# EasyEDA Pro project ProProject_PressureSensor_2023-10-08.epro, board PCB1_2
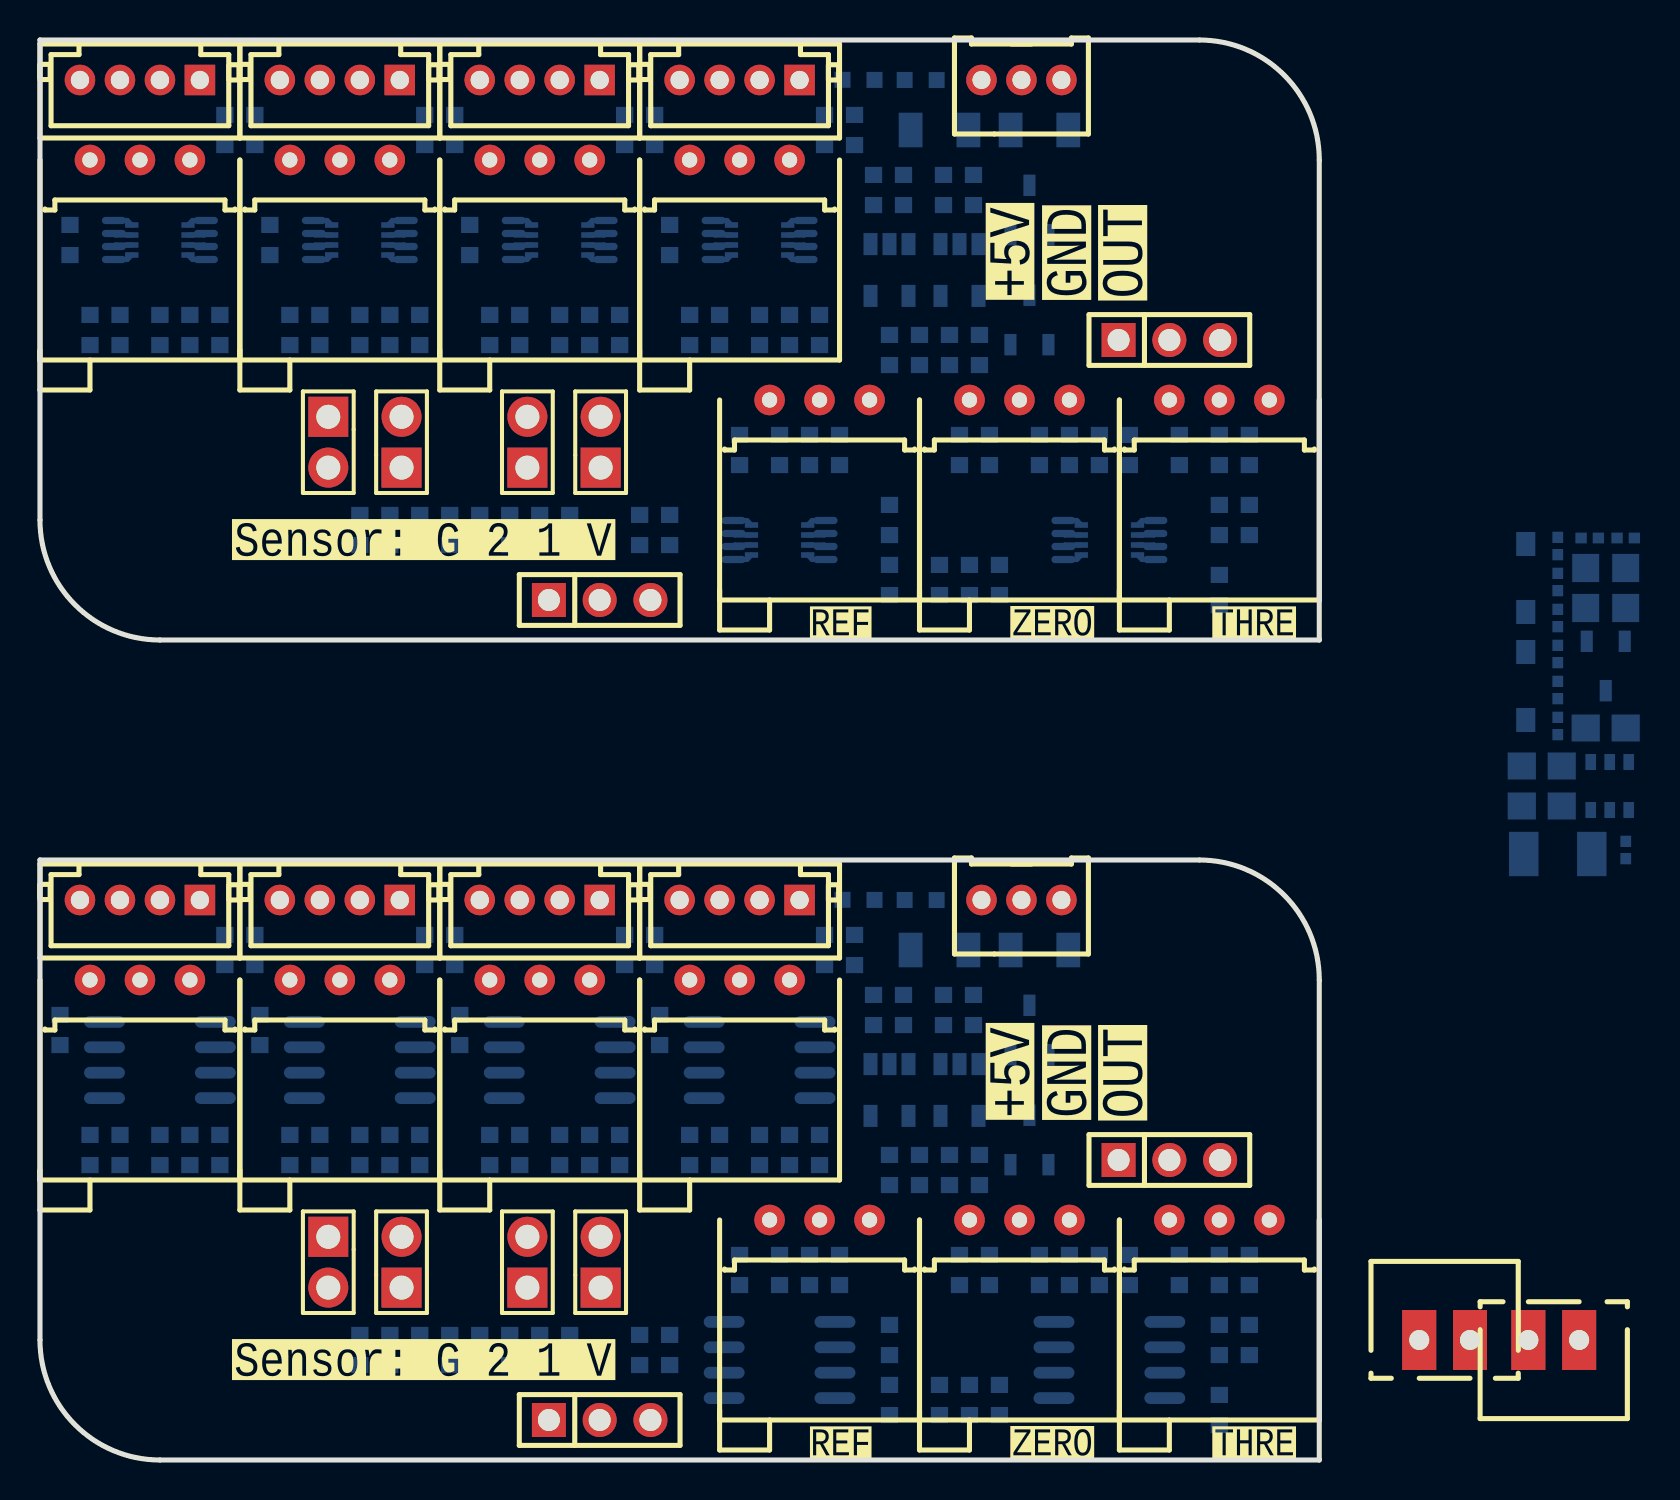
[diagram p5: board, top side]
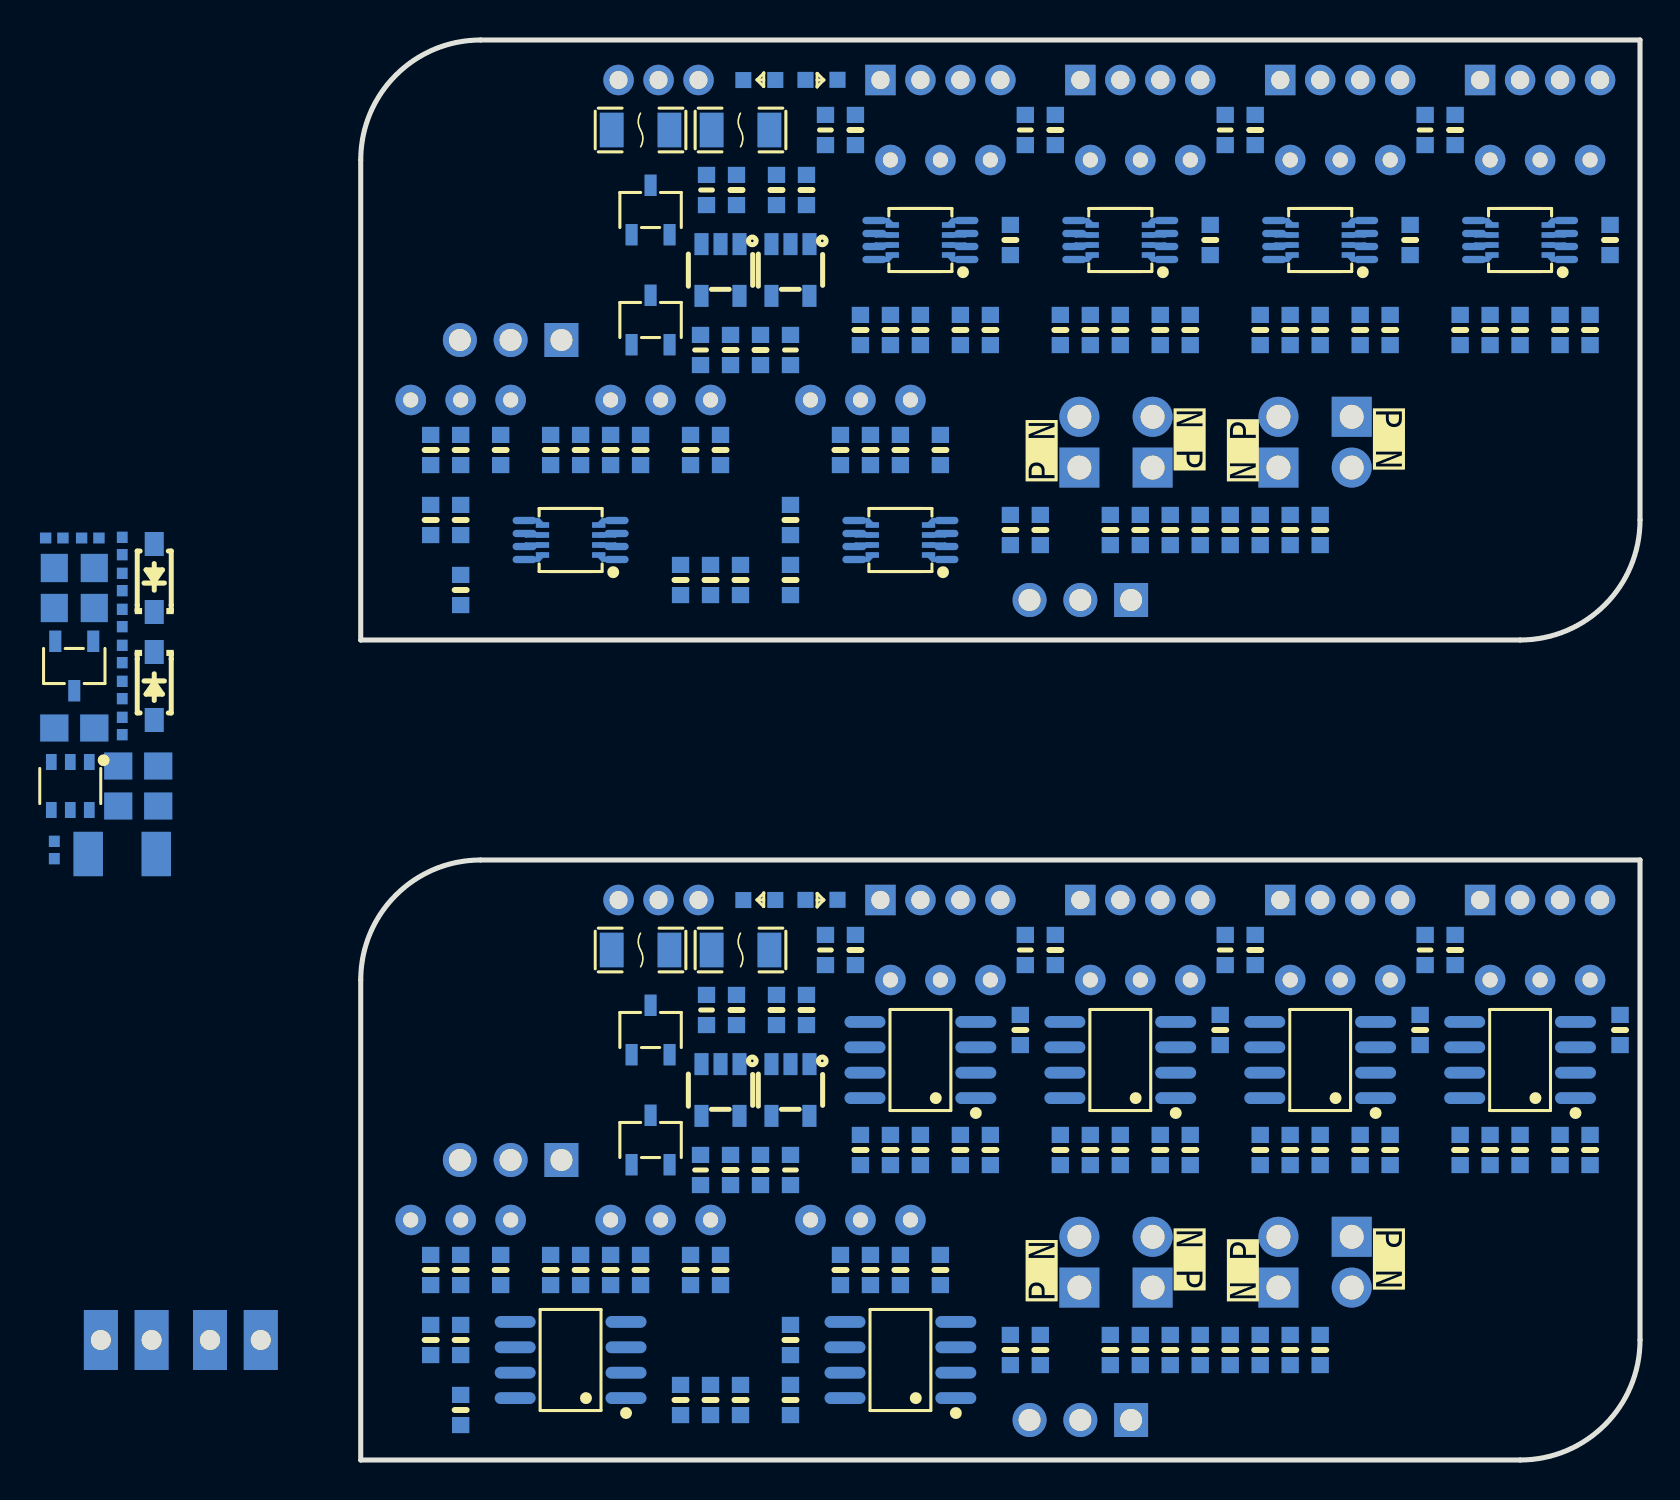
[diagram p6: board, bottom side, seen from below]

Outline 64 x 71 mm; copper layers: Top Layer, Inner1, Inner2, Bottom Layer. Coordinates in mm from the lower left corner of the outline.
Outline path: 0,47 0,71 58,71 arc(62.24,69.24) 64,65 64,41 6,41 arc(1.76,42.76) 0,47 ; 0,6 0,30 58,30 arc(62.24,28.24) 64,24 64,0 6,0 arc(1.76,1.76) 0,6
Stack: Top Layer 0.035mm / Dielectric1 0.48mm PP er 4.5 / Inner1 0.035mm / Dielectric2 0.48mm FR4 er 4.5 / Inner2 0.035mm / Dielectric3 0.48mm PP er 4.5 / Bottom Layer 0.035mm

## Design rules (mm)
template: 自定义配置
spacing copperThickness1oz (default): track to track 0.102, other pairs 0.152 to 0.3
spacing copperThickness2oz: track to track 0.203, other pairs 0.152 to 0.3
track width copperThickness1oz (default): min 0.127, default 0.254, max 2.54
track width copperThickness2oz: min 0.203, default 0.254, max 2.54
differential pair differentialPair (default): width min 0.127, default 0.254, max 2.54; gap min 0.152, default 0.152
via viaSize (default): diameter min 0.5, default 0.61, max 10; hole min 0.3, default 0.305, max 6.3
net GND uses innerPlaneGND

## Placement (name value [footprint] x y rotation side)
C1  22uF  [R0603]  46.7 22.5 270 bottom
C1#2  -  [R0603]  46.7 63.5 270 bottom
C2  0.1uF  [R0603]  45.2 63.5 90 bottom
C2#2  -  [R0603]  45.2 22.5 90 bottom
C3  1uF  [R0603]  41.7 63.5 90 bottom
C3#2  -  [R0603]  41.7 22.5 90 bottom
C4  10uF  [R0603]  42.5 14.5 90 bottom
C4#2  -  [R0603]  42.5 55.5 90 bottom
C5  0.1uF  [R0603]  44 55.5 270 bottom
C5#2  -  [R0603]  44 14.5 270 bottom
C7  10uF  [R0603]  47 14.5 90 bottom
C7#2  -  [R0603]  47 55.5 90 bottom
C8  0.1uF  [R0603]  45.5 55.5 270 bottom
C8#2  -  [R0603]  45.5 14.5 270 bottom
C9  22uF  [R0603]  10.75 66.5 90 bottom
C9#2  -  [R0603]  10.75 25.5 90 bottom
C10  100p  [R0603]  31.5 5.5 90 bottom
C10#2  -  [R0603]  31.5 46.5 90 bottom
C11  100p  [R0603]  2.5 56.5 90 bottom
C11#2  -  [R0603]  2.5 15.5 90 bottom
C12  100p  [R0603]  38.5 9.5 90 bottom
C12#2  -  [R0603]  38.5 50.5 90 bottom
C13  100p  [R0603]  9 56.5 270 bottom
C13#2  -  [R0603]  9 15.5 270 bottom
C14  100p  [R0603]  46.5 44 90 bottom
C14#2  -  [R0603]  46.5 3 90 bottom
C15  100p  [R0603]  59 47 90 bottom
C15#2  -  [R0603]  59 6 90 bottom
C16  1uF  [R0603]  40 9.5 90 bottom
C16#2  -  [R0603]  40 50.5 90 bottom
C17  1uF  [R0603]  50 50.5 90 bottom
C17#2  -  [R0603]  50 9.5 90 bottom
C18  1uF  [R0603]  59 50.5 90 bottom
C18#2  -  [R0603]  59 9.5 90 bottom
C19  22uF  [R0603]  20.75 66.5 90 bottom
C19#2  -  [R0603]  20.75 25.5 90 bottom
C20  100p  [R0603]  12.5 56.5 90 bottom
C20#2  -  [R0603]  12.5 15.5 90 bottom
C20#3  -  [R0402]  79.33 46.1 0 bottom
C21  100p  [R0603]  19 56.5 270 bottom
C21#2  -  [R0603]  19 15.5 270 bottom
C22  0.1uF  [R0603]  1.5 61 90 bottom
C22#2  -  [R0603]  1 21.5 270 bottom
C23  0.1uF  [R0603]  11.5 61 90 bottom
C23#2  -  [R0603]  11 21.5 270 bottom
C24  0.1uF  [R0603]  21.5 61 90 bottom
C24#2  -  [R0603]  21 21.5 270 bottom
C25  0.1uF  [R0603]  31.5 61 90 bottom
C25#2  -  [R0603]  31 21.5 270 bottom
C26  0.1uF  [R0603]  42.5 44 90 bottom
C26#2  -  [R0603]  42.5 3 90 bottom
C27  0.1uF  [R0603]  59 43.5 90 bottom
C27#2  -  [R0603]  59 2.5 90 bottom
C27#3  -  [C0805]  77.33 43.6 270 bottom
C28  22uF  [R0603]  30.75 66.5 90 bottom
C28#2  -  [R0603]  30.75 25.5 90 bottom
C29  100p  [R0603]  22.5 56.5 90 bottom
C29#2  -  [R0603]  22.5 15.5 90 bottom
C29#3  -  [C0805]  78.33 36.6 0 bottom
C30  22uF  [R0402]  79.33 30.5 90 bottom
C30#2  -  [R0603]  40.75 66.5 90 bottom
C30#3  -  [R0603]  40.75 25.5 90 bottom
C31  100p  [R0603]  32.5 56.5 90 bottom
C31#2  -  [R0603]  32.5 15.5 90 bottom
C31#3  -  [C0805]  75.13 32.7 180 bottom
C32  100p  [R0603]  29 56.5 270 bottom
C32#2  -  [R0603]  29 15.5 270 bottom
C32#3  -  [C0805]  75.13 34.7 180 bottom
C33  100p  [R0603]  39 56.5 270 bottom
C33#2  -  [R0603]  39 15.5 270 bottom
C33#3  -  [C0805]  79.33 43.6 270 bottom
CN1  HDGC2001WV-4P  [CONN-TH_B2B-XH-A-LF-SN]  70.27 6.5 0 top
CN1#2  -  [CONN-TH_4P-P2.00_HDGC_HDGC2001WV-4P]  5 28 180 top
CN1#3  -  [CONN-TH_4P-P2.00_HDGC_HDGC2001WV-4P]  5 69 180 top
CN2  HDGC2001WV-4P  [CONN-TH_B2B-XH-A-LF-SN]  75.73 5.5 180 top
CN2#2  -  [CONN-TH_4P-P2.00_HDGC_HDGC2001WV-4P]  15 28 180 top
CN2#3  -  [CONN-TH_4P-P2.00_HDGC_HDGC2001WV-4P]  15 69 180 top
CN3  HDGC2001WV-4P  [CONN-TH_4P-P2.00_HDGC_HDGC2001WV-4P]  25 28 180 top
CN3#2  -  [CONN-TH_4P-P2.00_HDGC_HDGC2001WV-4P]  25 69 180 top
CN4  HDGC2001WV-4P  [CONN-TH_4P-P2.00_HDGC_HDGC2001WV-4P]  35 28 180 top
CN4#2  -  [CONN-TH_4P-P2.00_HDGC_HDGC2001WV-4P]  35 69 180 top
D5  B5819W SL  [SOD-123_L2.7-W1.6-LS3.7-RD-1]  74.33 44.1 90 bottom
D6  B5819W SL  [SOD-123_L2.7-W1.6-LS3.7-RD-1]  74.33 38.7 270 bottom
F1  nSMD020-30V  [F1206]  45 66.5 180 bottom
F1#2  -  [F1206]  45 25.5 180 bottom
F2  nSMD020-30V  [F1206]  50 66.5 180 bottom
F2#2  -  [F1206]  50 25.5 180 bottom
H2  PZ254V-11-03P  [HDR-TH_3P-P2.54-V-M]  28 43 0 top
H2#2  -  [HDR-TH_3P-P2.54-V-M]  28 2 0 top
H4  PZ254V-11-03P  [HDR-TH_3P-P2.54-V-M]  56.5 56 0 top
H4#2  -  [HDR-TH_3P-P2.54-V-M]  56.5 15 0 top
H5  PZ254V-11-02P  [HDR-TH_2P-P2.54-V-M]  14.42 50.89 270 top
H5#2  -  [HDR-TH_2P-P2.54-V-M]  14.42 9.89 270 top
H6  PZ254V-11-02P  [HDR-TH_2P-P2.54-V-M]  24.38 50.89 90 top
H6#2  -  [HDR-TH_2P-P2.54-V-M]  24.38 9.89 90 top
H7  PZ254V-11-02P  [HDR-TH_2P-P2.54-V-M]  28.05 50.89 90 top
H7#2  -  [HDR-TH_2P-P2.54-V-M]  28.05 9.89 90 top
H8  PZ254V-11-02P  [HDR-TH_2P-P2.54-V-M]  18.09 50.89 90 top
H8#2  -  [HDR-TH_2P-P2.54-V-M]  18.09 9.89 90 top
L2  4.7uH  [L1210]  75.93 30.3 0 bottom
LED3  -  [LED_0603]  41 69 0 bottom
LED3#2  -  [LED_0603]  41 28 0 bottom
LED4  -  [LED_0603]  44.01 28.01 180 bottom
LED4#2  -  [LED_0603]  44.01 69.01 180 bottom
P1  PH-3A  [CONN-TH_12P-P2.00-H-W4.8_PH-3A]  49.1 69 270 top
P1#2  -  [CONN-TH_12P-P2.00-H-W4.8_PH-3A]  49.1 28 270 top
Q1  S8050  [SOT-23-3_L2.9-W1.6-P1.90-LS2.8-BR]  49.5 57 270 bottom
Q1#2  -  [SOT-23-3_L2.9-W1.6-P1.90-LS2.8-BR]  78.33 39.7 90 bottom
Q1#3  -  [SOT-23-3_L2.9-W1.6-P1.90-LS2.8-BR]  49.5 16 270 bottom
R2  2K  [R0603]  16 46.5 90 bottom
R2#2  -  [R0603]  16 5.5 90 bottom
R3  15K  [R0603]  30 46.5 90 bottom
R3#2  -  [R0603]  30 5.5 90 bottom
R4  2K  [R0603]  19 46.5 90 bottom
R4#2  -  [R0603]  19 5.5 90 bottom
R5  50  [RES-ADJ-TH_3P-L10.0-W10.0-P2.50-L]  5 65 0 top
R5#2  -  [RES-ADJ-TH_3P-L10.0-W10.0-P2.50-L]  5 24 0 top
R6  50  [R0603]  9.25 66.5 270 bottom
R6#2  -  [R0603]  9.25 25.5 270 bottom
R7  2K  [R0603]  22 46.5 90 bottom
R7#2  -  [R0603]  22 5.5 90 bottom
R8  2K  [R0603]  4 56.5 90 bottom
R8#2  -  [R0603]  4 15.5 90 bottom
R9  2K  [R0603]  25 46.5 90 bottom
R9#2  -  [R0603]  25 5.5 90 bottom
R10  2K  [R0603]  17.5 46.5 90 bottom
R10#2  -  [R0603]  17.5 5.5 90 bottom
R11  120  [R0603]  6 56.5 270 bottom
R11#2  -  [R0603]  6 15.5 270 bottom
R12  2K  [R0603]  20.5 46.5 90 bottom
R12#2  -  [R0603]  20.5 5.5 90 bottom
R13  2K  [R0603]  23.5 46.5 90 bottom
R13#2  -  [R0603]  23.5 5.5 90 bottom
R14  2K  [R0603]  45 44 90 bottom
R14#2  -  [R0603]  45 3 90 bottom
R14#3  -  [R0402]  75.93 45.7 270 bottom
R15  2K  [R0603]  7.5 56.5 270 bottom
R15#2  -  [R0603]  7.5 15.5 270 bottom
R15#3  -  [R0402]  77.53 46.1 180 bottom
R16  2K  [R0603]  26.5 46.5 90 bottom
R16#2  -  [R0603]  26.5 5.5 90 bottom
R16#3  -  [R0402]  75.93 40.3 90 bottom
R17  15K  [R0603]  37 9.5 90 bottom
R17#2  -  [R0603]  37 50.5 90 bottom
R17#3  -  [R0402]  75.93 42.1 90 bottom
R18  15K  [R0603]  48 44 90 bottom
R18#2  -  [R0603]  48 3 90 bottom
R18#3  -  [R0402]  75.93 38.5 90 bottom
R19  2K  [R0603]  53 50.5 90 bottom
R19#2  -  [R0603]  53 9.5 90 bottom
R19#3  -  [R0402]  75.93 36.7 90 bottom
R20  100K  [R0603]  54.5 50.5 90 bottom
R20#2  -  [R0603]  54.5 9.5 90 bottom
R20#3  -  [R0402]  75.93 43.9 90 bottom
R21  2K  [R0603]  46 9.5 270 bottom
R21#2  -  [R0603]  46 50.5 270 bottom
R22  2K  [R0603]  42.5 6 90 bottom
R22#2  -  [R0603]  42.5 47 90 bottom
R23  2K  [R0603]  51.5 9.5 270 bottom
R23#2  -  [R0603]  51.5 50.5 270 bottom
R24  2K  [R0603]  60.5 50.5 270 bottom
R24#2  -  [R0603]  60.5 9.5 270 bottom
R25  10K  [RES-ADJ-TH_3P-L10.0-W10.0-P2.50-L]  39 12 0 top
R25#2  -  [RES-ADJ-TH_3P-L10.0-W10.0-P2.50-L]  39 53 0 top
R26  10K  [RES-ADJ-TH_3P-L10.0-W10.0-P2.50-L]  49 12 0 top
R26#2  -  [RES-ADJ-TH_3P-L10.0-W10.0-P2.50-L]  49 53 0 top
R27  10K  [RES-ADJ-TH_3P-L10.0-W10.0-P2.50-L]  59 12 0 top
R27#2  -  [RES-ADJ-TH_3P-L10.0-W10.0-P2.50-L]  59 53 0 top
R28  5K  [R0603]  60.5 47 270 bottom
R28#2  -  [R0603]  60.5 6 270 bottom
R29  2K  [R0603]  35 9.5 90 bottom
R29#2  -  [R0603]  35 50.5 90 bottom
R30  2K  [R0603]  47.5 9.5 90 bottom
R30#2  -  [R0603]  47.5 50.5 90 bottom
R31  2K  [R0603]  57 50.5 90 bottom
R31#2  -  [R0603]  57 9.5 90 bottom
R33  50  [RES-ADJ-TH_3P-L10.0-W10.0-P2.50-L]  15 65 0 top
R33#2  -  [RES-ADJ-TH_3P-L10.0-W10.0-P2.50-L]  15 24 0 top
R34  50  [R0603]  19.25 66.5 270 bottom
R34#2  -  [R0603]  19.25 25.5 270 bottom
R35  2K  [R0603]  14 56.5 90 bottom
R35#2  -  [R0603]  14 15.5 90 bottom
R36  120  [R0603]  16 56.5 270 bottom
R36#2  -  [R0603]  16 15.5 270 bottom
R37  2K  [R0603]  17.5 56.5 270 bottom
R37#2  -  [R0603]  17.5 15.5 270 bottom
R38  50  [RES-ADJ-TH_3P-L10.0-W10.0-P2.50-L]  25 65 0 top
R38#2  -  [RES-ADJ-TH_3P-L10.0-W10.0-P2.50-L]  25 24 0 top
R39  50  [R0603]  29.25 66.5 270 bottom
R39#2  -  [R0603]  29.25 25.5 270 bottom
R40  50  [RES-ADJ-TH_3P-L10.0-W10.0-P2.50-L]  35 65 0 top
R40#2  -  [RES-ADJ-TH_3P-L10.0-W10.0-P2.50-L]  35 24 0 top
R41  2K  [R0603]  24 56.5 90 bottom
R41#2  -  [R0603]  24 15.5 90 bottom
R42  50  [R0603]  39.25 66.5 270 bottom
R42#2  -  [R0603]  39.25 25.5 270 bottom
R43  2K  [R0603]  34 56.5 90 bottom
R43#2  -  [R0603]  34 15.5 90 bottom
R44  120  [R0603]  26 56.5 270 bottom
R44#2  -  [R0603]  26 15.5 270 bottom
R45  120  [R0603]  36 56.5 270 bottom
R45#2  -  [R0603]  36 15.5 270 bottom
R46  2K  [R0603]  27.5 56.5 270 bottom
R46#2  -  [R0603]  27.5 15.5 270 bottom
R47  2K  [R0603]  37.5 56.5 270 bottom
R47#2  -  [R0603]  37.5 15.5 270 bottom
R48  10K  [R0603]  43.2 22.5 270 bottom
R48#2  -  [R0603]  43.2 63.5 270 bottom
TV1  ESDA5V3L  [SOT-23-3_L2.9-W1.6-P1.90-LS2.8-BR]  49.5 62.5 270 bottom
TV1#2  -  [SOT-23-3_L2.9-W1.6-P1.90-LS2.8-BR]  49.5 21.5 270 bottom
U1  LP5907MFX-4.5/NOPB  [TSOT-23-5_L2.9-W1.6-P0.95-LS2.8-BR]  42.5 18.5 90 bottom
U1#2  -  [TSOT-23-5_L2.9-W1.6-P0.95-LS2.8-BR]  42.5 59.5 90 bottom
U2  LP5907MFX-4.5/NOPB  [TSOT-23-5_L2.9-W1.6-P0.95-LS2.8-BR]  46 59.5 90 bottom
U2#2  -  [TSOT-23-5_L2.9-W1.6-P0.95-LS2.8-BR]  46 18.5 90 bottom
U2#3  -  [TSOT-23-6_L2.9-W1.6-P0.95-LS2.8-BR]  78.53 33.7 90 bottom
U3  TLV2333IDGKR  [VSSOP-8_L3.0-W3.0-P0.65-LS5.0-BL]  6 61 90 bottom
U3#2  -  [SOIC-8_L4.9-W3.9-P1.27-LS6.0-BL]  6 20 90 bottom
U4  TLV2333IDGKR  [VSSOP-8_L3.0-W3.0-P0.65-LS5.0-BL]  37 46 90 bottom
U4#2  -  [SOIC-8_L4.9-W3.9-P1.27-LS6.0-BL]  37 5 90 bottom
U5  TLV2333IDGKR  [VSSOP-8_L3.0-W3.0-P0.65-LS5.0-BL]  53.5 46 90 bottom
U5#2  -  [SOIC-8_L4.9-W3.9-P1.27-LS6.0-BL]  53.5 5 90 bottom
U6  TLV2333IDGKR  [VSSOP-8_L3.0-W3.0-P0.65-LS5.0-BL]  16 61 90 bottom
U6#2  -  [SOIC-8_L4.9-W3.9-P1.27-LS6.0-BL]  16 20 90 bottom
U7  TLV2333IDGKR  [VSSOP-8_L3.0-W3.0-P0.65-LS5.0-BL]  26 61 90 bottom
U7#2  -  [SOIC-8_L4.9-W3.9-P1.27-LS6.0-BL]  26 20 90 bottom
U8  TLV2333IDGKR  [VSSOP-8_L3.0-W3.0-P0.65-LS5.0-BL]  36 61 90 bottom
U8#2  -  [SOIC-8_L4.9-W3.9-P1.27-LS6.0-BL]  36 20 90 bottom

## Footprints (pads in the part's own frame, mm; a bottom-side part is the same pattern mirrored in y, then rotated)
C0805
  rect 1.41x1.35 smd: 1(-1,0) 2(1,0)
CONN-TH_4P-P2.00_HDGC_HDGC2001WV-4P
  rect 1.524x1.524 hole 0.914: 1(-3,0)
  round 1.524 hole 0.914: 2(-1,0) 3(1,0) 4(3,0)
CONN-TH_12P-P2.00-H-W4.8_PH-3A
  round 1.524 hole 0.9: 1(0,2) 2(0,0) 3(0,-2)
CONN-TH_B2B-XH-A-LF-SN
  rect 1.7x3 hole 1: 1(1.27,-0.5) 2(-1.27,-0.5)
F1206
  rect 1.19x1.728 smd: 1(-1.445,0) 2(1.445,0)
HDR-TH_2P-P2.54-V-M
  rect 2x2 hole 1.2: 1(-1.27,0)
  round 2 hole 1.2: 2(1.27,0)
HDR-TH_3P-P2.54-V-M
  rect 1.7x1.7 hole 1.1: 1(-2.54,0)
  round 1.7 hole 1.1: 2(0,0) 3(2.54,0)
L1210
  rect 1.474x2.22 smd: 1(-1.703,0) 2(1.703,0)
LED_0603
  rect 0.8x0.8 smd: 1(-0.851,-0.01) 2(0.75,-0.005)
R0402
  rect 0.566x0.54 smd: 1(-0.433,0) 2(0.433,0)
R0603
  rect 0.806x0.864 smd: 1(-0.753,0) 2(0.753,0)
RES-ADJ-TH_3P-L10.0-W10.0-P2.50-L
  round 1.524 hole 0.762: 1(-2.5,0) 2(0,0) 3(2.5,0)
SOD-123_L2.7-W1.6-LS3.7-RD-1
  rect 1.2x0.95 smd: 1(-1.7,0) 2(1.7,0)
SOIC-8_L4.9-W3.9-P1.27-LS6.0-BL
  oval 0.588x2.045 smd: 1(-1.905,-2.772) 2(-0.635,-2.772) 3(0.635,-2.772) 4(1.905,-2.772) 5(1.905,2.772) 6(0.635,2.772) 7(-0.635,2.772) 8(-1.905,2.772)
SOT-23-3_L2.9-W1.6-P1.90-LS2.8-BR
  rect 1.07x0.6 smd: 1(1.235,-0.95) 2(1.235,0.95) 3(-1.235,0)
TSOT-23-5_L2.9-W1.6-P0.95-LS2.8-BR
  rect 1.1x0.7 smd: 1(1.294,-0.951) 2(1.294,-0.001) 3(1.294,0.951) 4(-1.294,0.951) 5(-1.294,-0.949)
TSOT-23-6_L2.9-W1.6-P0.95-LS2.8-BR
  rect 0.8x0.532 smd: 1(1.2,-0.95) 2(1.2,0) 3(1.2,0.95) 4(-1.2,0.95) 5(-1.2,0) 6(-1.2,-0.95)
VSSOP-8_L3.0-W3.0-P0.65-LS5.0-BL
  oval 0.364x1.2 smd: 1(-0.975,-2.3) 2(-0.325,-2.3) 3(0.325,-2.3) 4(0.975,-2.3) 5(0.975,2.3) 6(0.325,2.3) 7(-0.325,2.3) 8(-0.975,2.3)
  rect 0.28x0.665 smd: 1(-0.75,-1.407) 2(-0.25,-1.407) 3(0.25,-1.407) 4(0.75,-1.407) 5(0.75,1.407) 6(0.25,1.407) 7(-0.25,1.407) 8(-0.75,1.407)

## Nets
GND: C1.1 C1#2.1 C2.2 C2#2.2 C3.2 C3#2.2 C4.1 C4#2.1 C5.2 C5#2.2 C7.1 C7#2.1 C8.2 C8#2.2 C9.1 C9#2.1 C15.2 C15#2.2 C16.1 C16#2.1 C17.1 C17#2.1 C18.1 C18#2.1 C19.1 C19#2.1 C20#3.1 C22.1 C22#2.1 C23.1 C23#2.1 C24.1 C24#2.1 C25.1 C25#2.1 C26.1 C26#2.1 C27.1 C27#2.1 C27#3.1 C28.1 C28#2.1 C29#3.1 C30#2.1 C30#3.1 C31#3.1 C32#3.1 C33#3.1 CN1.1 CN1#2.4 CN1#3.4 CN2.1 CN2#2.4 CN2#3.4 CN3.4 CN3#2.4 CN4.4 CN4#2.4 H2.1 H2#2.1 H4.2 H4#2.2 LED3.1 LED3#2.1 P1.2 P1#2.2 Q1.2 Q1#3.2 R15#3.1 R16#3.1 R19#3.1 R29.1 R29#2.1 R30.1 R30#2.1 R31.1 R31#2.1 TV1.3 TV1#2.3 U1.2 U1#2.2 U2.2 U2#2.2 U2#3.4 U3.8 U3#2.8 U4.4 U4#2.4 U5.4 U5#2.4 U6.8 U6#2.8 U7.8 U7#2.8 U8.8 U8#2.8
VCC: C4.2 C4#2.2 C5.1 C5#2.1 C22.2 C22#2.2 C23.2 C23#2.2 C24.2 C24#2.2 C25.2 C25#2.2 C26.2 C26#2.2 C27.2 C27#2.2 C27#3.2 C29#3.2 D5.1 R20#3.2 U1.5 U1#2.5 U2#3.2 U2#3.3 U3.4 U3#2.4 U4.8 U4#2.8 U5.8 U5#2.8 U6.4 U6#2.4 U7.4 U7#2.4 U8.4 U8#2.4
VCCREF: C7.2 C7#2.2 C8.1 C8#2.1 R5.1 R5.2 R5#2.1 R5#2.2 R6.2 R6#2.2 R21.2 R21#2.2 R23.2 R23#2.2 R24.2 R24#2.2 R33.1 R33.2 R33#2.1 R33#2.2 R34.2 R34#2.2 R38.1 R38.2 R38#2.1 R38#2.2 R39.2 R39#2.2 R40.1 R40.2 R40#2.1 R40#2.2 R42.2 R42#2.2 U2.5 U2#2.5
N1: C11.2 C11#2.2 H5.2 H5#2.2 R2.2 R2#2.2 R8.2 R8#2.2 U3.1 U3#2.1
N2: C20.2 C20#2.2 H8.1 H8#2.1 R4.2 R4#2.2 R35.2 R35#2.2 U6.1 U6#2.1
N3: C29.2 C29#2.2 H6.2 H6#2.2 R7.2 R7#2.2 R41.2 R41#2.2 U7.1 U7#2.1
N4: C31.2 C31#2.2 H7.2 H7#2.2 R9.2 R9#2.2 R43.2 R43#2.2 U8.1 U8#2.1
OUTPUT: F2.2 F2#2.2 LED4.1 LED4#2.1 Q1.3 Q1#3.3
P1: C13.1 C13#2.1 H5.1 H5#2.1 R10.2 R10#2.2 R15.1 R15#2.1 U3.7 U3#2.7
P2: C21.1 C21#2.1 H8.2 H8#2.2 R12.2 R12#2.2 R37.1 R37#2.1 U6.7 U6#2.7
P3: C32.1 C32#2.1 H6.1 H6#2.1 R13.2 R13#2.2 R46.1 R46#2.1 U7.7 U7#2.7
P4: C33.1 C33#2.1 H7.1 H7#2.1 R16.2 R16#2.2 R47.1 R47#2.1 U8.7 U8#2.7
VO: C31#3.2 C32#3.2 CN2.2 D6.2 L2.2
$1N582: Q1#2.2 R16#3.2
$1N1003: C30.2 U2#3.6
$1N1154: C30.1 L2.1 U2#3.5
$1N1169: R18#3.1 R19#3.2 U2#3.1
$1N1283: C20#3.2 C33#3.2 Q1#2.1 R14#3.1 R15#3.2
$1N1424: Q1#2.3 R17#3.1 R18#3.2
$1N2401: D6.1 R17#3.2 R20#3.1
$1N2410: CN1.2 D5.2 R14#3.2
$1N30553: CN1#2.3 CN1#3.3 U3.3 U3#2.3
$1N30561: CN1#2.2 CN1#3.2 U3.5 U3#2.5
$1N30605: C11.1 C11#2.1 R8.1 R8#2.1 R11.2 R11#2.2 U3.2 U3#2.2
$1N30608: C13.2 C13#2.2 R11.1 R11#2.1 R15.2 R15#2.2 U3.6 U3#2.6
$1N32010: R21.1 R25.3
$1N32012: R25.1 R29.2
$1N32045: C16.2 R25.2 U4#2.5
$1N32103: R22.2 R22#2.2 U4.6 U4#2.6
$1N32162: C10.2 C10#2.2 R3.2 R3#2.2 R10.1 R10#2.1 R12.1 R12#2.1 R13.1 R13#2.1 R16.1 R16#2.1 U4.2 U4#2.2
$1N32193: C12.1 C12#2.1 R17.1 R17#2.1 R22.1 R22#2.1 U4.7 U4#2.7
$1N32196: C12.2 C12#2.2 R2.1 R2#2.1 R4.1 R4#2.1 R7.1 R7#2.1 R9.1 R9#2.1 R17.2 R17#2.2 U4.3 U4#2.3
$1N32429: R23.1 R23#2.1 R26.3 R26#2.3
$1N32431: R26.1 R26#2.1 R30.2 R30#2.2
$1N32433: C17.2 C17#2.2 R26.2 R26#2.2 U5.3 U5#2.3
$1N32985: R24.1 R24#2.1 R27.3 R27#2.3
$1N32987: R27.1 R27#2.1 R31.2 R31#2.2
$1N32997: C18.2 C18#2.2 R27.2 R27#2.2 U5.6 U5#2.6
$1N33007: R19.2 R19#2.2 R20.2 R20#2.2 U5.5 U5#2.5
$1N33240: Q1.1 Q1#3.1 R28.1 R28#2.1
$1N33276: C15.1 C15#2.1 R20.1 R20#2.1 R28.2 R28#2.2 U5.7 U5#2.7
$1N35532: C10.1 C10#2.1 H2.2 H2#2.2 R3.1 R3#2.1 R14.1 R14#2.1 U4.1 U4#2.1
$1N36334: C14.1 C14#2.1 H2.3 H2#2.3 R18.1 R18#2.1 R19.1 R19#2.1 U5.1 U5#2.1
$1N36352: C14.2 C14#2.2 R14.2 R14#2.2 R18.2 R18#2.2 U5.2 U5#2.2
$1N36780: CN2#2.3 CN2#3.3 U6.3 U6#2.3
$1N36784: CN2#2.2 CN2#3.2 U6.5 U6#2.5
$1N36792: C20.1 C20#2.1 R35.1 R35#2.1 R36.2 R36#2.2 U6.2 U6#2.2
$1N36797: C21.2 C21#2.2 R36.1 R36#2.1 R37.2 R37#2.2 U6.6 U6#2.6
$1N37205: CN3.3 CN3#2.3 U7.3 U7#2.3
$1N37209: CN3.2 CN3#2.2 U7.5 U7#2.5
$1N37217: C29.1 C29#2.1 R41.1 R41#2.1 R44.2 R44#2.2 U7.2 U7#2.2
$1N37222: C32.2 C32#2.2 R44.1 R44#2.1 R46.2 R46#2.2 U7.6 U7#2.6
$1N37630: CN4.3 CN4#2.3 U8.3 U8#2.3
$1N37634: CN4.2 CN4#2.2 U8.5 U8#2.5
$1N37642: C31.1 C31#2.1 R43.1 R43#2.1 R45.2 R45#2.2 U8.2 U8#2.2
$1N37647: C33.2 C33#2.2 R45.1 R45#2.1 R47.2 R47#2.2 U8.6 U8#2.6
$1N37723: C19.2 C19#2.2 CN2#2.1 CN2#3.1 R33.3 R33#2.3 R34.1 R34#2.1
$1N37747: C28.2 C28#2.2 CN3.1 CN3#2.1 R38.3 R38#2.3 R39.1 R39#2.1
$1N37752: C9.2 C9#2.2 CN1#2.1 CN1#3.1 R5.3 R5#2.3 R6.1 R6#2.1
$1N37762: C30#2.2 C30#3.2 CN4.1 CN4#2.1 R40.3 R40#2.3 R42.1 R42#2.1
$1N42503: F1.1 F1#2.1 H4.1 H4#2.1 P1.3 P1#2.3
$1N42542: F2.1 F2#2.1 H4.3 H4#2.3 P1.1 P1#2.1
$1N42787: LED3.2 LED3#2.2 LED4.2 LED4#2.2 R48.1 R48#2.1
$1N42798: C1.2 C1#2.2 C2.1 C2#2.1 C3.1 C3#2.1 F1.2 F1#2.2 R48.2 R48#2.2 TV1.1 TV1.2 TV1#2.1 TV1#2.2 U1.1 U1.3 U1#2.1 U1#2.3 U2.1 U2.3 U2#2.1 U2#2.3
$1N49584: C16#2.2 R21#2.1 R25#2.1 R25#2.2 R25#2.3 R29#2.2 U4.5

Pads without a net: U1 4; U1#2 4; U2 4; U2#2 4

## Copper pours and planes (outline as drawn; the poured copper is in the pictures)
GND on Top Layer: 0,30 64,30 64,0 0,0
GND on Top Layer: 0,71 64,71 64,41 0,41
GND on Inner2: 48.7,29.42 49.5,29.42 49.5,27.6 48.7,27.6
GND on Inner2: 25.06,2.4 25.86,2.4 25.86,0.49 25.06,0.49
GND on Inner2: 11.6,29.42 12.4,29.42 12.4,27.6 11.6,27.6
GND on Inner2: 31.6,29.42 32.4,29.42 32.4,27.6 31.6,27.6
GND on Inner2: 20.58,28.4 22.4,28.4 22.4,27.6 20.58,27.6
GND on Inner2: 48.7,28.4 49.5,28.4 49.5,26.58 48.7,26.58
GND on Inner2: 11.6,28.4 12.4,28.4 12.4,26.58 11.6,26.58
GND on Inner2: 0.58,28.4 2.4,28.4 2.4,27.6 0.58,27.6
GND on Inner2: 56.1,16.51 56.9,16.51 56.9,14.6 56.1,14.6
GND on Inner2: 31.6,28.4 32.4,28.4 32.4,26.58 31.6,26.58
GND on Inner2: 21.6,28.4 22.4,28.4 22.4,26.58 21.6,26.58
GND on Inner2: 0.26,29.74 63.74,29.74 63.74,0.26 0.26,0.26
GND on Inner2: 56.1,15.4 56.9,15.4 56.9,13.49 56.1,13.49
GND on Inner2: 1.6,28.4 2.4,28.4 2.4,26.58 1.6,26.58
GND on Inner2: 30.58,28.4 32.4,28.4 32.4,27.6 30.58,27.6
GND on Inner2: 10.58,28.4 12.4,28.4 12.4,27.6 10.58,27.6
GND on Inner2: 25.06,3.51 25.86,3.51 25.86,1.6 25.06,1.6
GND on Inner2: 1.6,29.42 2.4,29.42 2.4,27.6 1.6,27.6
GND on Inner2: 23.95,2.4 25.86,2.4 25.86,1.6 23.95,1.6
GND on Inner2: 21.6,29.42 22.4,29.42 22.4,27.6 21.6,27.6
VCC on Inner1: 0.5,21.66 63.5,21.66 63.5,0.5 0.5,0.5
VCCREF on Inner1: 0.5,29.5 63.5,29.5 63.5,6.66 0.5,6.66

Small or netless copper shapes (teardrops, artwork), in the pictures only: 31 on Inner1

## Text on the board
Bottom Silkscreen Layer: P N | N P
Top Silkscreen Layer: REF | ZERO | THRE | Sensor: G 2 1 V | +5V | GND | OUT
